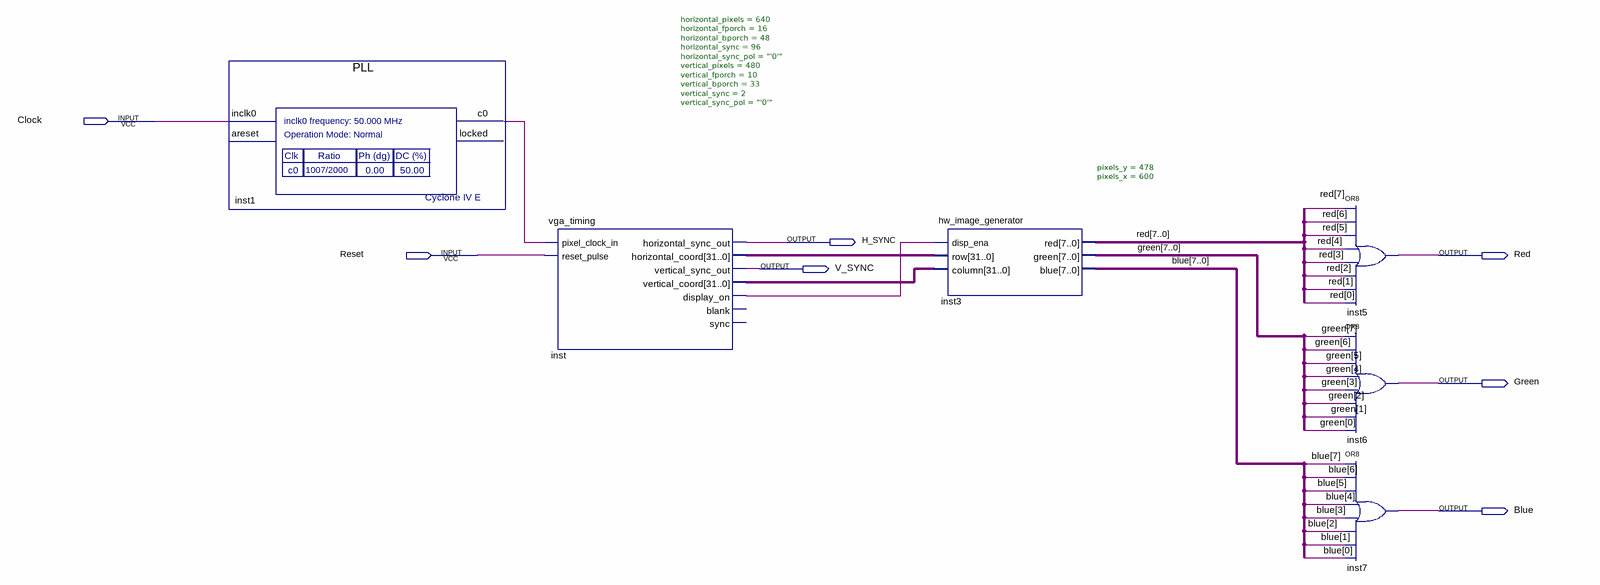
[diagram p0: schematic sheet]
// Quartus schematic Test.bdf as structural Verilog: 6 symbols, 7 pins
module Test (
  input  Clock,
  input  Reset,
  output H_SYNC,
  output Red,
  output V_SYNC,
  output Green,
  output Blue
);

  wire inst1_c0, inst_display_on;
  wire [7:0] Blue_bus, Green_bus, Red_bus;
  wire [31:0] inst_horizontal_coord, inst_vertical_coord;

  PLL inst1 (.inclk0(Clock), .c0(inst1_c0));  // open: areset, locked
  vga_timing #(.horizontal_pixels(640), .horizontal_fporch(16), .horizontal_bporch(48), .horizontal_sync(96), .horizontal_sync_pol("'0'"), .vertical_pixels(480), .vertical_fporch(10), .vertical_bporch(33), .vertical_sync(2), .vertical_sync_pol("'0'")) inst (
    .pixel_clock_in(inst1_c0), .reset_pulse(Reset), .horizontal_sync_out(H_SYNC),
    .horizontal_coord(inst_horizontal_coord), .vertical_sync_out(V_SYNC),
    .vertical_coord(inst_vertical_coord), .display_on(inst_display_on));  // open: blank, sync
  hw_image_generator #(.pixels_y(478), .pixels_x(600)) inst3 (
    .disp_ena(inst_display_on), .row(inst_horizontal_coord), .column(inst_vertical_coord), .red(Red_bus),
    .green(Green_bus), .blue(Blue_bus));
  or inst5 (Red, Red_bus[7], Red_bus[6], Red_bus[5], Red_bus[4], Red_bus[3], Red_bus[2], Red_bus[1], Red_bus[0]);
  or inst6 (Green, Green_bus[7], Green_bus[6], Green_bus[5], Green_bus[4], Green_bus[3], Green_bus[2], Green_bus[1], Green_bus[0]);
  or inst7 (Blue, Blue_bus[7], Blue_bus[6], Blue_bus[5], Blue_bus[4], Blue_bus[3], Blue_bus[2], Blue_bus[1], Blue_bus[0]);
endmodule
